# EAGLE design board_v2 (EAGLE 6.2)
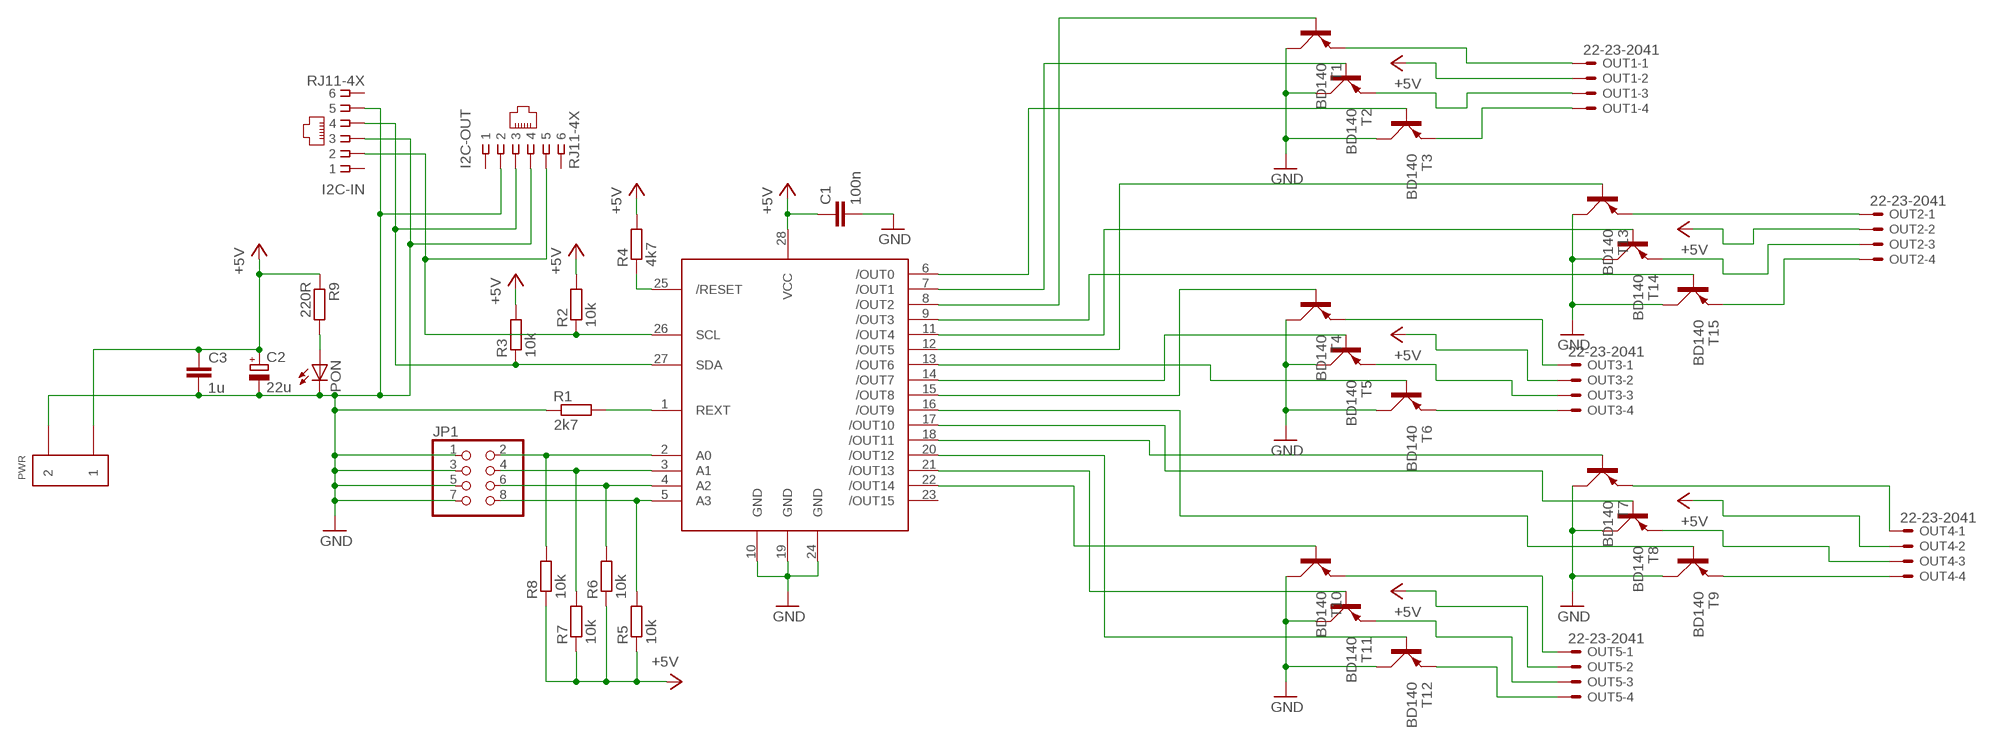
[diagram p0: schematic, sheet 1]

## Parts
C1  100n  C-EUC1206  [C1206]
C2  22u  CPOL-EUE2.5-5  [E2,5-5]
C3  1u  C-EUC1206  [C1206]
I2C-IN  RJ11-4X  [RJ11-NO_SHIELD]
I2C-OUT  RJ11-4X  [RJ11-NO_SHIELD]
IC1  TLC59116  [TSSOP28]
JP1  PINHD-2X4  [2X04]
OUT1  22-23-2041  [22-23-2041]
OUT2  22-23-2041  [22-23-2041]
OUT3  22-23-2041  [22-23-2041]
OUT4  22-23-2041  [22-23-2041]
OUT5  22-23-2041  [22-23-2041]
PON  LEDCHIPLED_1206  [CHIPLED_1206]
PWR  ARK210/2EX  [ARK210/2EX]
R1  2k7  R-EU_R1206  [R1206]
R2  10k  R-EU_R1206  [R1206]
R3  10k  R-EU_R1206  [R1206]
R4  4k7  R-EU_R1206  [R1206]
R5  10k  R-EU_R1206  [R1206]
R6  10k  R-EU_R1206  [R1206]
R7  10k  R-EU_R1206  [R1206]
R8  10k  R-EU_R1206  [R1206]
R9  220R  R-EU_R1206  [R1206]
T1  BD140  [TO126AV]
T2  BD140  [TO126AV]
T3  BD140  [TO126AV]
T4  BD140  [TO126AV]
T5  BD140  [TO126AV]
T6  BD140  [TO126AV]
T7  BD140  [TO126AV]
T8  BD140  [TO126AV]
T9  BD140  [TO126AV]
T10  BD140  [TO126AV]
T11  BD140  [TO126AV]
T12  BD140  [TO126AV]
T13  BD140  [TO126AV]
T14  BD140  [TO126AV]
T15  BD140  [TO126AV]

## Nets
+5V: C1.1 C2.+ C3.1 IC1.28(VCC) OUT1.2 OUT2.2 OUT3.2 OUT4.2 OUT5.2 PWR.P$1 R2.2 R3.2 R4.2 R5.1 R6.1 R7.1 R8.1 R9.1
GND: C1.2 C2.- C3.2 I2C-IN.3 I2C-IN.5 I2C-OUT.2 I2C-OUT.4 IC1.10(GND) IC1.19(GND) IC1.24(GND) JP1.1 JP1.3 JP1.5 JP1.7 PON.C PWR.P$2 R1.1 T1.C T2.C T3.C T4.C T5.C T6.C T7.C T8.C T9.C T10.C T11.C T12.C T13.C T14.C T15.C
N$1: OUT1.1 T1.E
N$2: OUT1.3 T2.E
N$3: OUT1.4 T3.E
N$4: OUT3.1 T4.E
N$5: OUT3.3 T5.E
N$6: OUT3.4 T6.E
N$7: OUT4.1 T7.E
N$8: OUT4.3 T8.E
N$9: OUT4.4 T9.E
N$10: OUT5.1 T10.E
N$11: OUT5.3 T11.E
N$12: OUT5.4 T12.E
N$13: OUT2.1 T13.E
N$14: OUT2.3 T14.E
N$15: OUT2.4 T15.E
N$16: IC1.9(/OUT3) T15.B
N$17: IC1.2(A0) JP1.2 R8.2
N$18: IC1.3(A1) JP1.4 R7.2
N$19: IC1.4(A2) JP1.6 R6.2
N$20: IC1.5(A3) JP1.8 R5.2
N$21: IC1.1(REXT) R1.2
N$22: IC1.6(/OUT0) T3.B
N$23: IC1.7(/OUT1) T2.B
N$24: IC1.8(/OUT2) T1.B
N$25: IC1.11(/OUT4) T14.B
N$26: IC1.12(/OUT5) T13.B
N$27: IC1.13(/OUT6) T6.B
N$28: IC1.14(/OUT7) T5.B
N$29: IC1.15(/OUT8) T4.B
N$30: IC1.16(/OUT9) T9.B
N$31: IC1.17(/OUT10) T8.B
N$32: IC1.18(/OUT11) T7.B
N$33: IC1.20(/OUT12) T12.B
N$34: IC1.21(/OUT13) T11.B
N$35: IC1.22(/OUT14) T10.B
N$36: IC1.25(/RESET) R4.1
N$37: I2C-IN.2 I2C-OUT.5 IC1.26(SCL) R2.1
N$38: I2C-IN.4 I2C-OUT.3 IC1.27(SDA) R3.1
N$39: PON.A R9.2
Unconnected: I2C-IN.1 I2C-IN.6 I2C-OUT.1 I2C-OUT.6 IC1.23(/OUT15)

## Library data of the parts
C1 C3 = resistor:C-EU: CAPACITOR, European symbol
C2 = resistor:CPOL-EU: POLARIZED CAPACITOR, European symbol
I2C-IN I2C-OUT = con-tycoelectronics:RJ11: CORCOM Modular RJ Jacks No Shield Source: www.tycoelectronics.com .. ENG_DS_1654001_1099_RJ_L_0507.pdf; MPN: 6609214-3; OC_FARNELL: unknown; OC_NEWARK: 19R7022
IC1 = tlc:TLC59116
JP1 = pinhead:PINHD-2X4: PIN HEADER
OUT1-OUT5 = con-molex:22-23-2041: .100" (2.54mm) Center Header - 4 Pin; MF: MOLEX; MPN: 22-23-2041; OC_FARNELL: 1462920; OC_NEWARK: 38C0355
PON = led:LED: LED OSRAM: - CHIPLED LG R971, LG N971, LY N971, LG Q971, LY Q971, LO R971, LY R971 LH N974, LH R974 LS Q976, LO Q976, LY Q976 LO Q996 - Hyper CHIPLED LW Q18S LB Q993, LB Q99A, LB R99A - SideLED LS A670, LO A670, LY A670, LG A670, LP A670 LB A673, LV A673, LT A673, LW A673 LH A674 LY A675 LS A676, LA A676, LO A676, LY A676, LW A676 LS A679, LY A679, LG A679 - Hyper Micro SIDELED® LS Y876, LA Y876, LO Y876, LY Y876 LT Y87S - SmartLED LW L88C, LW L88S LB L89C, LB L89S, LG L890 LS L89K, LO L89K, LY L89K LS L896, LA L896, LO L896, LY L896 - TOPLED LS T670, LO T670, LY T670, LG T670, LP T670 LSG T670, LSP T670, LSY T670, LOP T670, LYG T670 LG T671, LOG T671, LSG T671 LB T673, LV T673, LT T673, LW T673 LH T674 LS T676, LA T676, LO T676, LY T676, LB T676, LH T676, LSB T676, LW T676 LB T67C, LV T67C, LT T67C, LS T67K, LO T67K, LY T67K, LW E67C LS E67B, LA E67B, LO E67B, LY E67B, LB E67C, LV E67C, LT E67C LW T67C LS T679, LY T679, LG T679 LS T770, LO T770, LY T770, LG T770, LP T770 LB T773, LV T773, LT T773, LW T773 LH T774 LS E675, LA E675, LY E675, LS T675 LS T776, LA T776, LO T776, LY T776, LB T776 LHGB T686 LT T68C, LB T68C - Hyper Mini TOPLED® LB M676 - Mini TOPLED Santana® LG M470 LS M47K, LO M47K, LY M47K Source: http://www.osram.convergy.de LUXEON: - LUMILED® LXK2-PW12-R00, LXK2-PW12-S00, LXK2-PW14-U00, LXK2-PW14-V00 LXK2-PM12-R00, LXK2-PM12-S00, LXK2-PM14-U00 LXK2-PE12-Q00, LXK2-PE12-R00, LXK2-PE12-S00, LXK2-PE14-T00, LXK2-PE14-U00 LXK2-PB12-K00, LXK2-PB12-L00, LXK2-PB12-M00, LXK2-PB14-N00, LXK2-PB14-P00, LXK2-PB14-Q00 LXK2-PR12-L00, LXK2-PR12-M00, LXK2-PR14-Q00, LXK2-PR14-R00 LXK2-PD12-Q00, LXK2-PD12-R00, LXK2-PD12-S00 LXK2-PH12-R00, LXK2-PH12-S00 LXK2-PL12-P00, LXK2-PL12-Q00, LXK2-PL12-R00 Source: www.luxeon.com KINGBRIGHT: KA-3528ASYC Source: www.kingbright.com
PWR = con-brm:ARK210/2EX
R1-R9 = resistor:R-EU_: RESISTOR, European symbol
T1-T15 = transistor-power:BD140: PNP TRANSISTOR

## Board
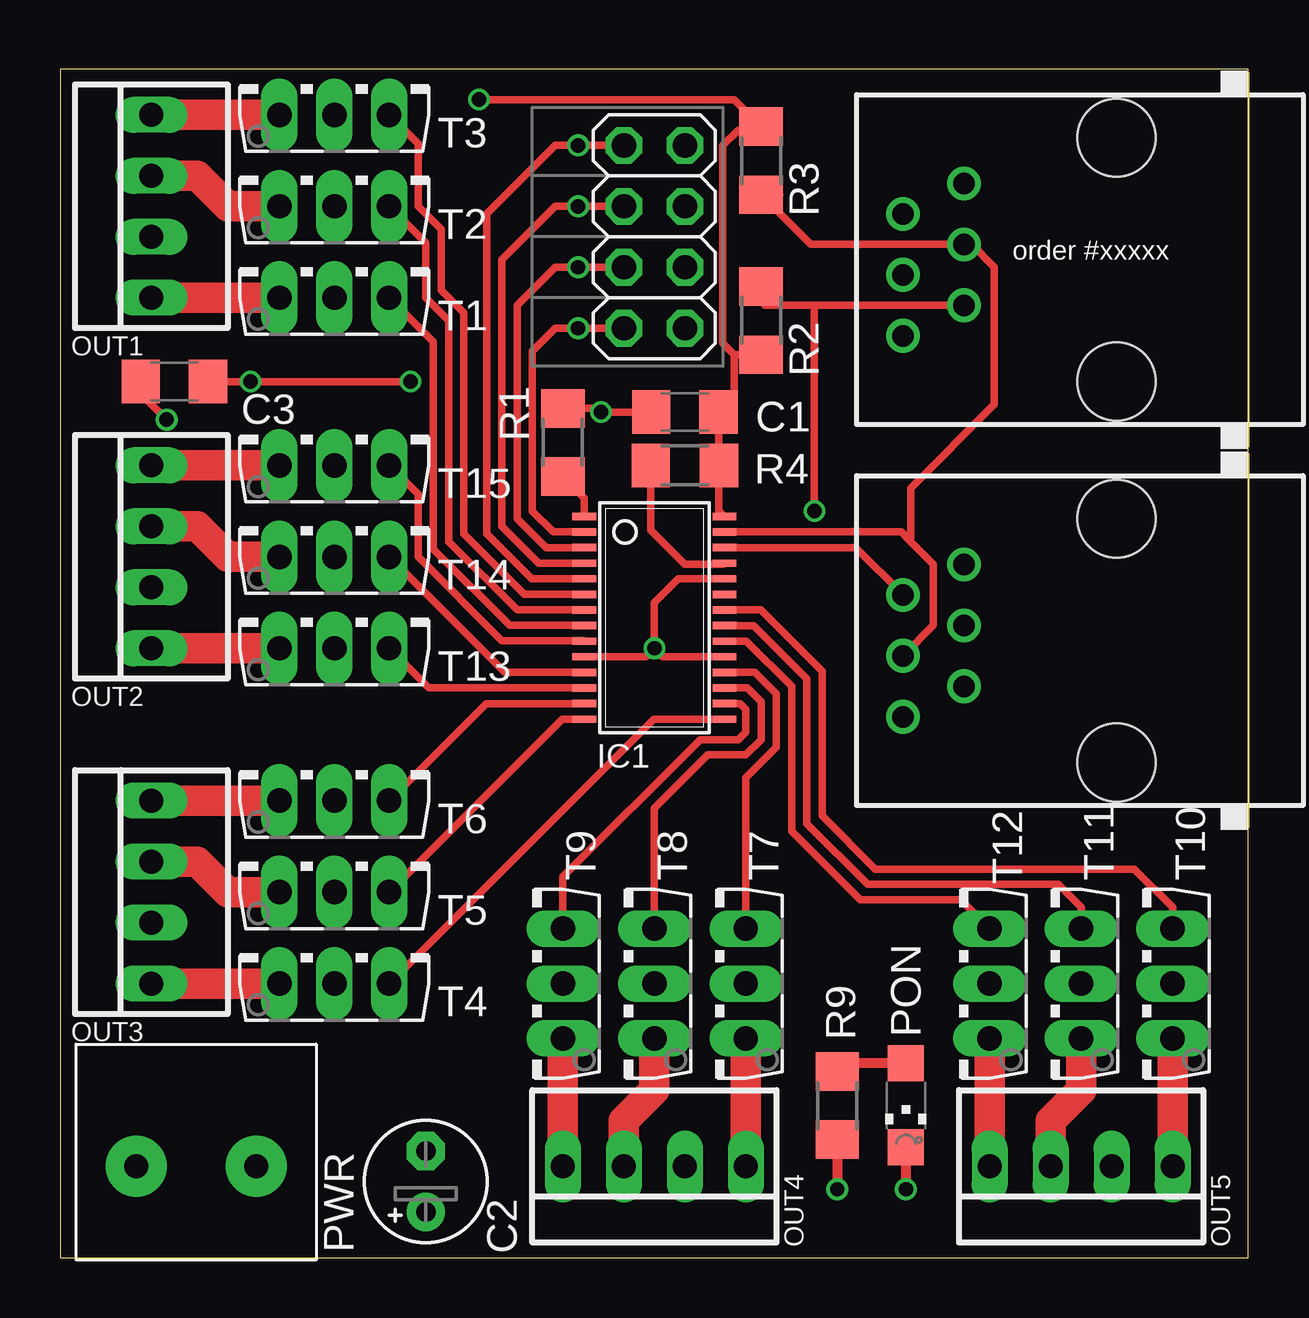
[diagram p1: board, top side]
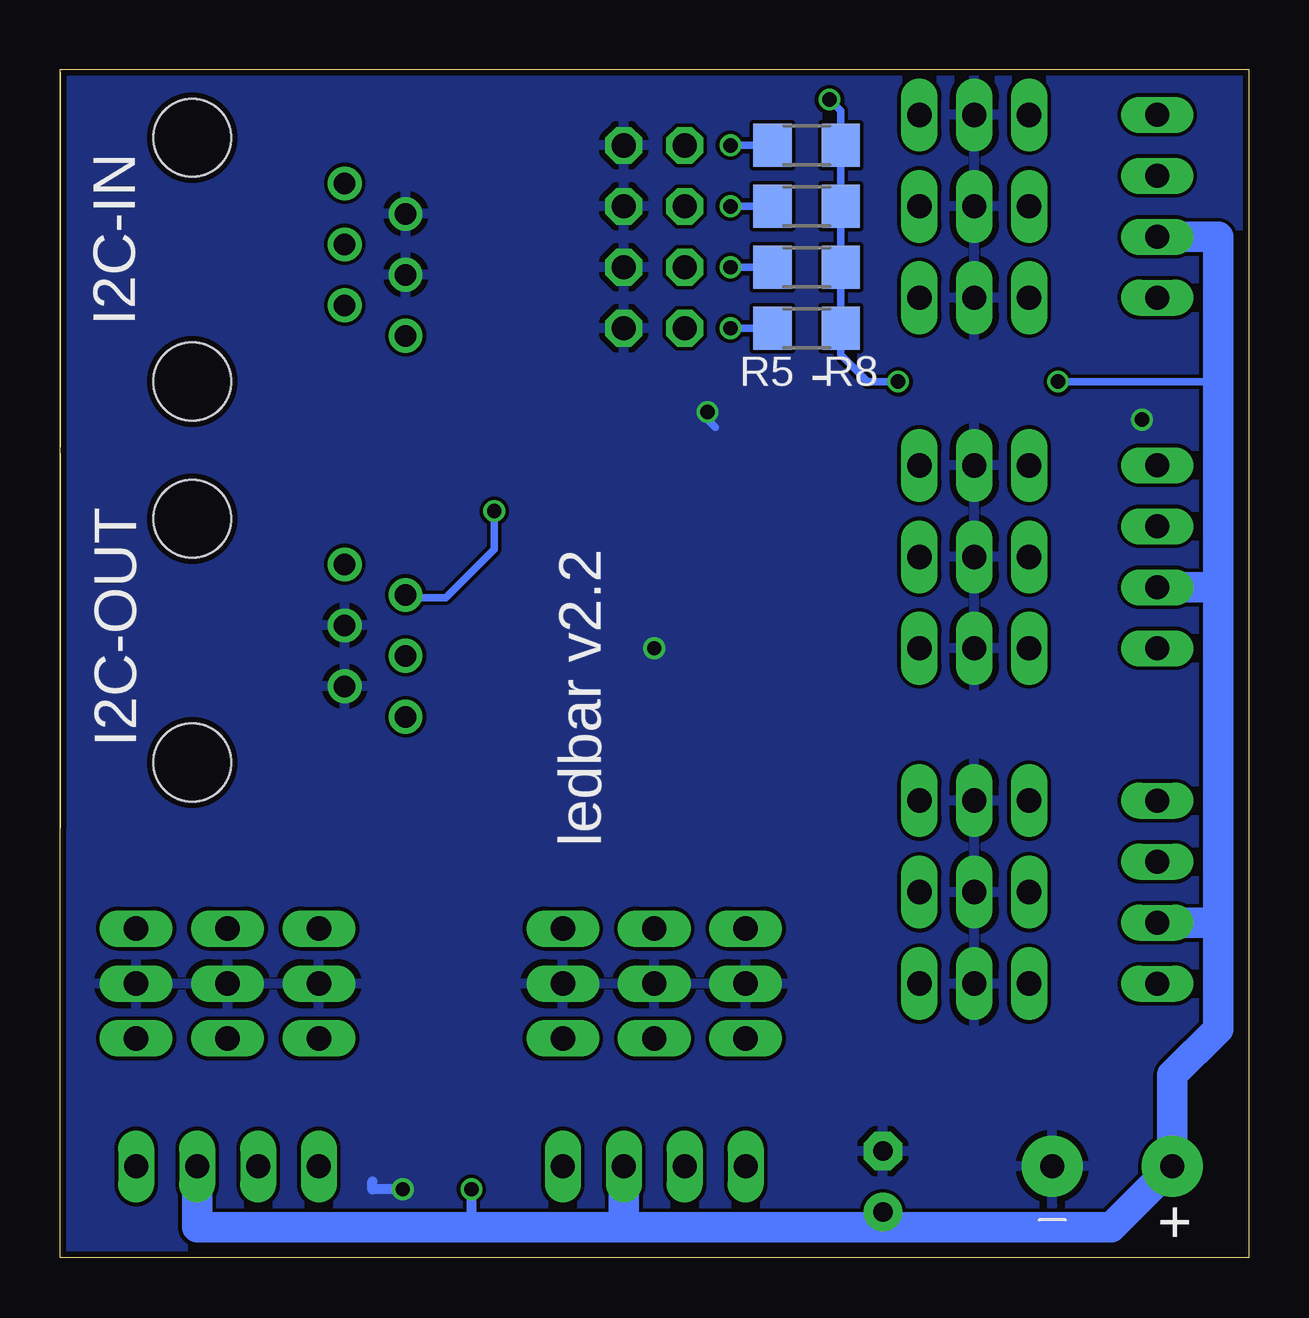
[diagram p2: board, bottom side, seen from below]

Size 49.53 x 49.52 mm. Coordinates in mm from the lower left corner, seen from the top.
Outline: 0,0 49.52,0 49.52,49.52 0,49.52 0,0
Copper layers (1*16): Top 0.035mm / dielectric 1.5mm / Bottom 0.035mm
Design rules: minimum track width 6mil, minimum drill 12mil, track to track 6mil, track to pad 6mil, pad to pad 6mil, via to via 6mil, smd to smd 0mil, copper to edge 10mil, drill to drill 10mil, minimum pad ring 10mil, minimum via ring 6mil, stop-mask expansion 2mil, vias tented up to drill 100mil, thermal gap 10mil

### Footprints (pad centres in the part's own frame; a part is rotated, then mirrored left to right if it is on the bottom)
C1206 = smd 1.6 x 1.8: 1 -1.4,0; 2 1.4,0
E2,5-5 = drill 0.813 pad 1.6: + -1.27,0 | drill 0.813 pad 1.6 octagon: - 1.27,0
RJ11-NO_SHIELD = drill 0.9 pad 1.4: 1 -3.175,8.89; 2 -1.905,6.35; 3 -0.635,8.89; 4 0.635,6.35; 5 1.905,8.89; 6 3.175,6.35 | hole 3.251: -5.08,0; 5.08,0
TSSOP28 = smd 0.305 x 0.991: 1 -4.225,-2.918; 2 -3.575,-2.918; 3 -2.925,-2.918; 4 -2.275,-2.918; 5 -1.625,-2.918; 6 -0.975,-2.918; 7 -0.325,-2.918; 8 0.325,-2.918; 9 0.975,-2.918; 10 1.625,-2.918; 11 2.275,-2.918; 12 2.925,-2.918; 13 3.575,-2.918; 14 4.225,-2.918; 15 4.225,2.918; 16 3.575,2.918; 17 2.925,2.918; 18 2.275,2.918; 19 1.625,2.918; 20 0.975,2.918; 21 0.325,2.918; 22 -0.325,2.918; 23 -0.975,2.918; 24 -1.625,2.918; 25 -2.275,2.918; 26 -2.925,2.918; 27 -3.575,2.918; 28 -4.225,2.918
2X04 = drill 1.016 octagon: 1 -3.81,-1.27; 2 -3.81,1.27; 3 -1.27,-1.27; 4 -1.27,1.27; 5 1.27,-1.27; 6 1.27,1.27; 7 3.81,-1.27; 8 3.81,1.27
22-23-2041 = drill 1 long: 1 -3.81,0; 2 -1.27,0; 3 1.27,0; 4 3.81,0
CHIPLED_1206 = smd 1.5 x 1.5: A 0,-1.75; C 0,1.75
ARK210/2EX = drill 1 pad 2.54: P$1 0,0; P$2 5,0
R1206 = smd 1.6 x 1.803: 1 -1.422,0; 2 1.422,0
TO126AV = drill 1.016 long: B 2.286,-1.27; C 0,-1.27; E -2.286,-1.27

### Placement (x,y rotation side)
C1  26.04,35.24 180 top
C2  15.24,3.17 90 top
C3  4.76,36.51 180 top
I2C-IN  44.02,41.59 90 top
I2C-OUT  44.02,25.72 90 top
IC1  24.77,26.67 270 top
JP1  24.77,42.55 90 top
OUT1  3.81,43.81 90 top
OUT2  3.81,29.21 90 top
OUT3  3.81,15.24 90 top
OUT4  24.77,3.81 180 top
OUT5  42.55,3.81 180 top
PON  35.24,6.35 180 top
PWR  3.17,3.81 0 top
R1  20.95,33.97 270 top
R2  29.21,39.05 270 top
R3  29.21,45.72 90 top
R4  26.04,33.02 0 top
R5  18.41,46.35 180 bottom
R6  18.41,43.81 180 bottom
R7  18.41,41.27 180 bottom
R8  18.41,38.73 180 bottom
R9  32.38,6.35 90 top
T1  11.43,41.27 0 top
T2  11.43,45.09 0 top
T3  11.43,48.9 0 top
T4  11.43,12.7 0 top
T5  11.43,16.51 0 top
T6  11.43,20.32 0 top
T7  27.3,11.43 90 top
T8  23.5,11.43 90 top
T9  19.68,11.43 90 top
T10  45.09,11.43 90 top
T11  41.27,11.43 90 top
T12  37.47,11.43 90 top
T13  11.43,26.67 0 top
T14  11.43,30.48 0 top
T15  11.43,34.29 0 top

### Tracks (layer width: path | path; a pad name or v marks a point on that pad's centre or on a via)
+5V  (via drill 0.6)
  Top 0.305: IC1.28 27.46,31.12 R4.2 27.46,35.22 C1.1 28.09,35.9 28.09,37.63 | R2.2 28.09,37.63 | 28.09,37.63 27.62,38.1 27.62,46.35 28.26,46.99 29.69,46.99 R3.2 28.09,48.26 v17.46,48.26 | v14.61,36.51 v7.94,36.51 C3.1
  Top 0.406: R9.1 v32.38,2.86
  Bottom 0.305: R5.1 R6.1 R7.1 R8.1 | R8.1 16.99,37.63 15.88,36.51 v14.61,36.51 | v7.94,36.51 1.27,36.51 | R8.1 16.99,47.79 v17.46,48.26
  Bottom 0.406: v32.38,2.86 32.38,1.27
  Bottom 1.27: 1.27,13.97 1.27,9.53 3.17,7.62 PWR.P$1 5.71,1.27 15.24,1.27 | 1.27,13.97 1.27,27.94 | 1.27,27.94 1.27,36.51 1.27,42.55 OUT1.2 | 26.04,1.27 32.38,1.27 43.81,1.27 OUT5.2 | 26.04,1.27 15.24,1.27 | C2.+ 15.24,1.27 | OUT4.2 26.04,1.27 | OUT3.2 1.27,13.97 | OUT2.2 1.27,27.94
GND  (via drill 0.6)
  Top 0.305: C1.2 v22.54,35.24 22.39,35.4 R1.1 | IC1.10 24.41,25.05 v24.77,25.4 | IC1.19 25.12,25.05 v24.77,25.4 | IC1.24 25.75,28.3 24.77,27.3 v24.77,25.4 | C3.2 3.36,36.01 v4.45,34.92
  Top 0.406: PON.C v35.24,2.86
  Bottom 0.305: v22.54,35.24 22.54,34.92 22.23,34.61 | v24.77,25.4 24.77,25.72 | v4.45,34.92 4.76,34.92
  Bottom 0.406: v35.24,2.86 36.51,2.86 36.51,3.17
  pour Bottom: 0,50.16 50.8,50.16 50.8,-1.27 0,-1.27
N$1
  Top 1.27: OUT1.1 T1.E
N$2
  Top 1.27: OUT1.3 5.71,45.09 6.99,43.81 T2.E
N$3
  Top 1.27: T3.E OUT1.4
N$4
  Top 1.27: OUT3.1 T4.E
N$5
  Top 1.27: OUT3.3 5.71,16.51 6.99,15.24 T5.E
N$6
  Top 1.27: T6.E OUT3.4
N$7
  Top 1.27: OUT4.1 T7.E
N$8
  Top 1.27: OUT4.3 23.5,5.71 24.77,6.99 T8.E
N$9
  Top 1.27: OUT4.4 T9.E
N$10
  Top 1.27: OUT5.1 T10.E
N$11
  Top 1.27: OUT5.3 41.27,5.71 42.55,6.99 T11.E
N$12
  Top 1.27: OUT5.4 T12.E
N$13
  Top 1.27: OUT2.1 T13.E
N$14
  Top 1.27: OUT2.3 5.71,30.48 6.99,29.21 T14.E
N$15
  Top 1.27: T15.E OUT2.4
N$16
  Top 0.305: T15.B 14.92,31.81 14.92,29.21 18.41,25.72 21.82,25.72 IC1.9
N$17  (via drill 0.6)
  Top 0.305: IC1.2 20.55,30.25 19.68,31.11 19.68,37.78 20.64,38.73 v21.59,38.73 JP1.2
  Bottom 0.305: R8.2 v21.59,38.73
N$18  (via drill 0.6)
  Top 0.305: IC1.3 20.25,29.59 19.05,30.8 19.05,39.69 20.64,41.27 v21.59,41.27 JP1.4
  Bottom 0.305: R7.2 v21.59,41.27
N$19  (via drill 0.6)
  Top 0.305: IC1.4 19.95,28.95 18.41,30.48 18.41,41.59 20.64,43.81 v21.59,43.81 | v21.59,43.81 JP1.6 | v21.59,43.81 21.91,43.81
  Bottom 0.305: R6.2 v21.59,43.81
N$20  (via drill 0.6)
  Top 0.305: IC1.5 19.65,28.3 17.78,30.16 17.78,43.5 20.64,46.35 v21.59,46.35 JP1.8
  Bottom 0.305: R5.2 v21.59,46.35
N$21
  Top 0.305: IC1.1 21.85,31.66 R1.2
N$22
  Top 0.305: T3.B 14.92,46.42 14.92,43.81 15.88,42.86 15.88,40.32 16.83,39.37 16.83,30.16 19.34,27.64 IC1.6
N$23
  Top 0.305: T2.B 15.24,42.29 15.24,40.01 16.19,39.05 16.19,29.84 19.04,27 IC1.7
N$24
  Top 0.305: T1.B 15.56,38.16 15.56,29.53 18.73,26.35 IC1.8
N$25
  Top 0.305: IC1.11 18.53,24.39 T14.B
N$26
  Top 0.305: IC1.12 15.37,23.75 T13.B
N$27
  Top 0.305: IC1.13 17.76,23.09 T6.B
N$28
  Top 0.305: IC1.14 20.92,22.45 T5.B
N$29
  Top 0.305: IC1.15 24.73,22.45 T4.B
N$30
  Top 0.305: T9.B 20.95,15.88 26.67,21.59 28.26,21.59 28.57,21.91 28.57,22.86 28.34,23.09 IC1.16
N$31
  Top 0.305: IC1.17 28.64,23.75 29.21,23.18 29.21,21.59 28.57,20.95 26.99,20.95 24.77,18.73 T8.B
N$32
  Top 0.305: IC1.18 28.95,24.39 29.84,23.5 29.84,21.27 28.57,20 T7.B
N$33
  Top 0.305: IC1.20 28.6,25.7 30.48,23.81 30.48,17.78 33.34,14.92 37.53,14.92 T12.B
N$34
  Top 0.305: IC1.21 28.9,26.34 31.11,24.13 31.11,18.1 33.66,15.56 41.59,15.56 42.55,14.61 T11.B
N$35
  Top 0.305: IC1.22 29.2,27 31.75,24.45 31.75,18.41 33.97,16.19 44.77,16.19 46.35,14.61 T10.B
N$36
  Top 0.305: R4.1 24.61,30.31 26.04,28.89 27.63,28.89 IC1.25
N$37  (via drill 0.6)
  Top 0.305: 31.43,39.69 I2C-IN.2 | 31.43,39.69 v31.43,31.11 | 29.36,40.01 R2.1 29.36,39.69 31.43,39.69 | IC1.26 33.15,29.59 I2C-OUT.5
  Bottom 0.305: v31.43,31.11 31.43,29.53 33.46,27.5 35.01,27.5 I2C-OUT.5
N$38
  Top 0.305: 35.36,29.93 36.4,28.89 36.4,26.35 I2C-OUT.3 | 30,44.3 R3.1 31.28,42.23 I2C-IN.4 37.98,42.23 38.94,41.27 38.94,35.56 35.44,32.07 35.44,30.01 35.36,29.93 | IC1.27 35.04,30.25 35.36,29.93
N$39
  Top 0.406: PON.A 32.38,8.1 R9.2

### Text on the board
tNames: order #xxxxx
bNames: - | ledbar v2.2 | +
tDocu: 3 | 2 | 1 | 0
201bmp: /home/nephirus/brmlab.bmp